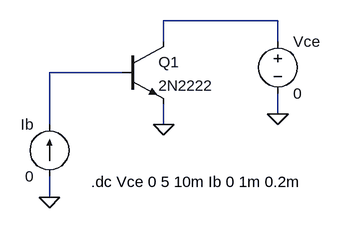
[diagram p0: schematic npn2.asc]
npn2.asc, the LTspice schematic file:
Version 4
SHEET 1 880 680
WIRE 416 32 240 32
WIRE 240 64 240 32
WIRE 416 64 416 32
WIRE 176 112 64 112
WIRE 416 176 416 144
WIRE 64 192 64 112
WIRE 240 192 240 160
WIRE 64 304 64 272
FLAG 64 304 0
FLAG 240 192 0
FLAG 416 176 0
SYMBOL current 64 272 R180
WINDOW 0 24 80 Left 2
WINDOW 3 24 0 Left 2
WINDOW 123 0 0 Left 0
WINDOW 39 0 0 Left 0
SYMATTR InstName Ib
SYMATTR Value 0
SYMBOL npn 176 64 R0
SYMATTR InstName Q1
SYMATTR Value 2N2222
SYMBOL voltage 416 48 R0
WINDOW 123 0 0 Left 0
WINDOW 39 0 0 Left 0
SYMATTR InstName Vce
SYMATTR Value 0
TEXT 128 280 Left 2 !.dc Vce 0 5 10m Ib 0 1m 0.2m

The netlist it stands for:
* npn2.asc
Ib 0 N002 0
Q1 N001 N002 0 0 2N2222
Vce N001 0 0
.model NPN NPN
.model PNP PNP
.lib standard.bjt
.dc Vce 0 5 10m Ib 0 1m 0.2m
.backanno
.end